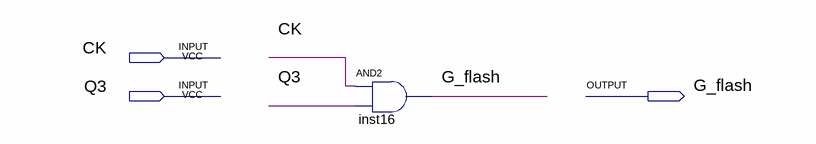
[diagram p0: schematic sheet]
// Quartus schematic G_flash.bdf as structural Verilog: 1 symbols, 3 pins
module G_flash (
  input  CK,
  input  Q3,
  output G_flash
);

  and inst16 (G_flash, CK, Q3);
endmodule
